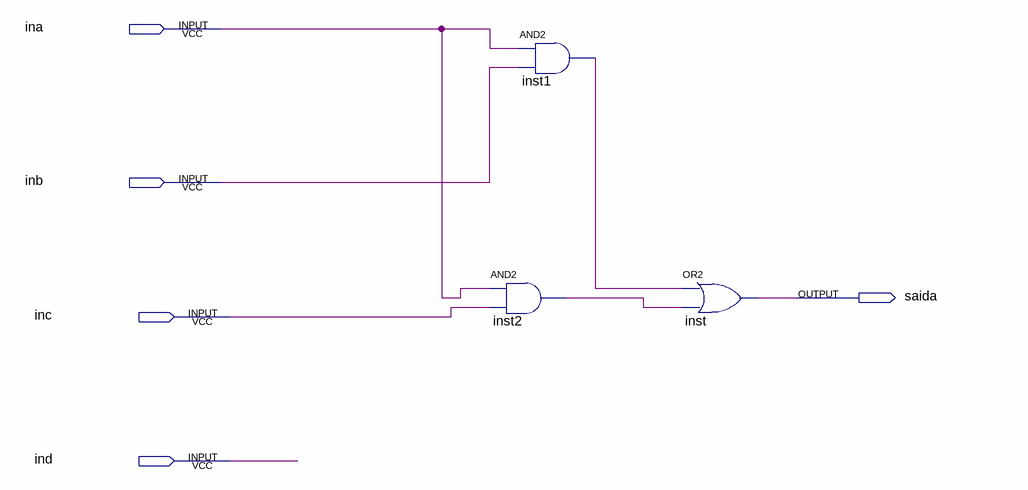
[diagram p0: schematic sheet]
// Quartus schematic ij.bdf as structural Verilog: 3 symbols, 5 pins
module ij (
  input  ina,
  input  inb,
  input  inc,
  input  ind,
  output saida
);

  wire inst1_out, inst2_out;

  and inst1 (inst1_out, ina, inb);
  and inst2 (inst2_out, ina, inc);
  or inst (saida, inst1_out, inst2_out);
endmodule
